# EAGLE design sacredHeart (EAGLE 9.1.3)
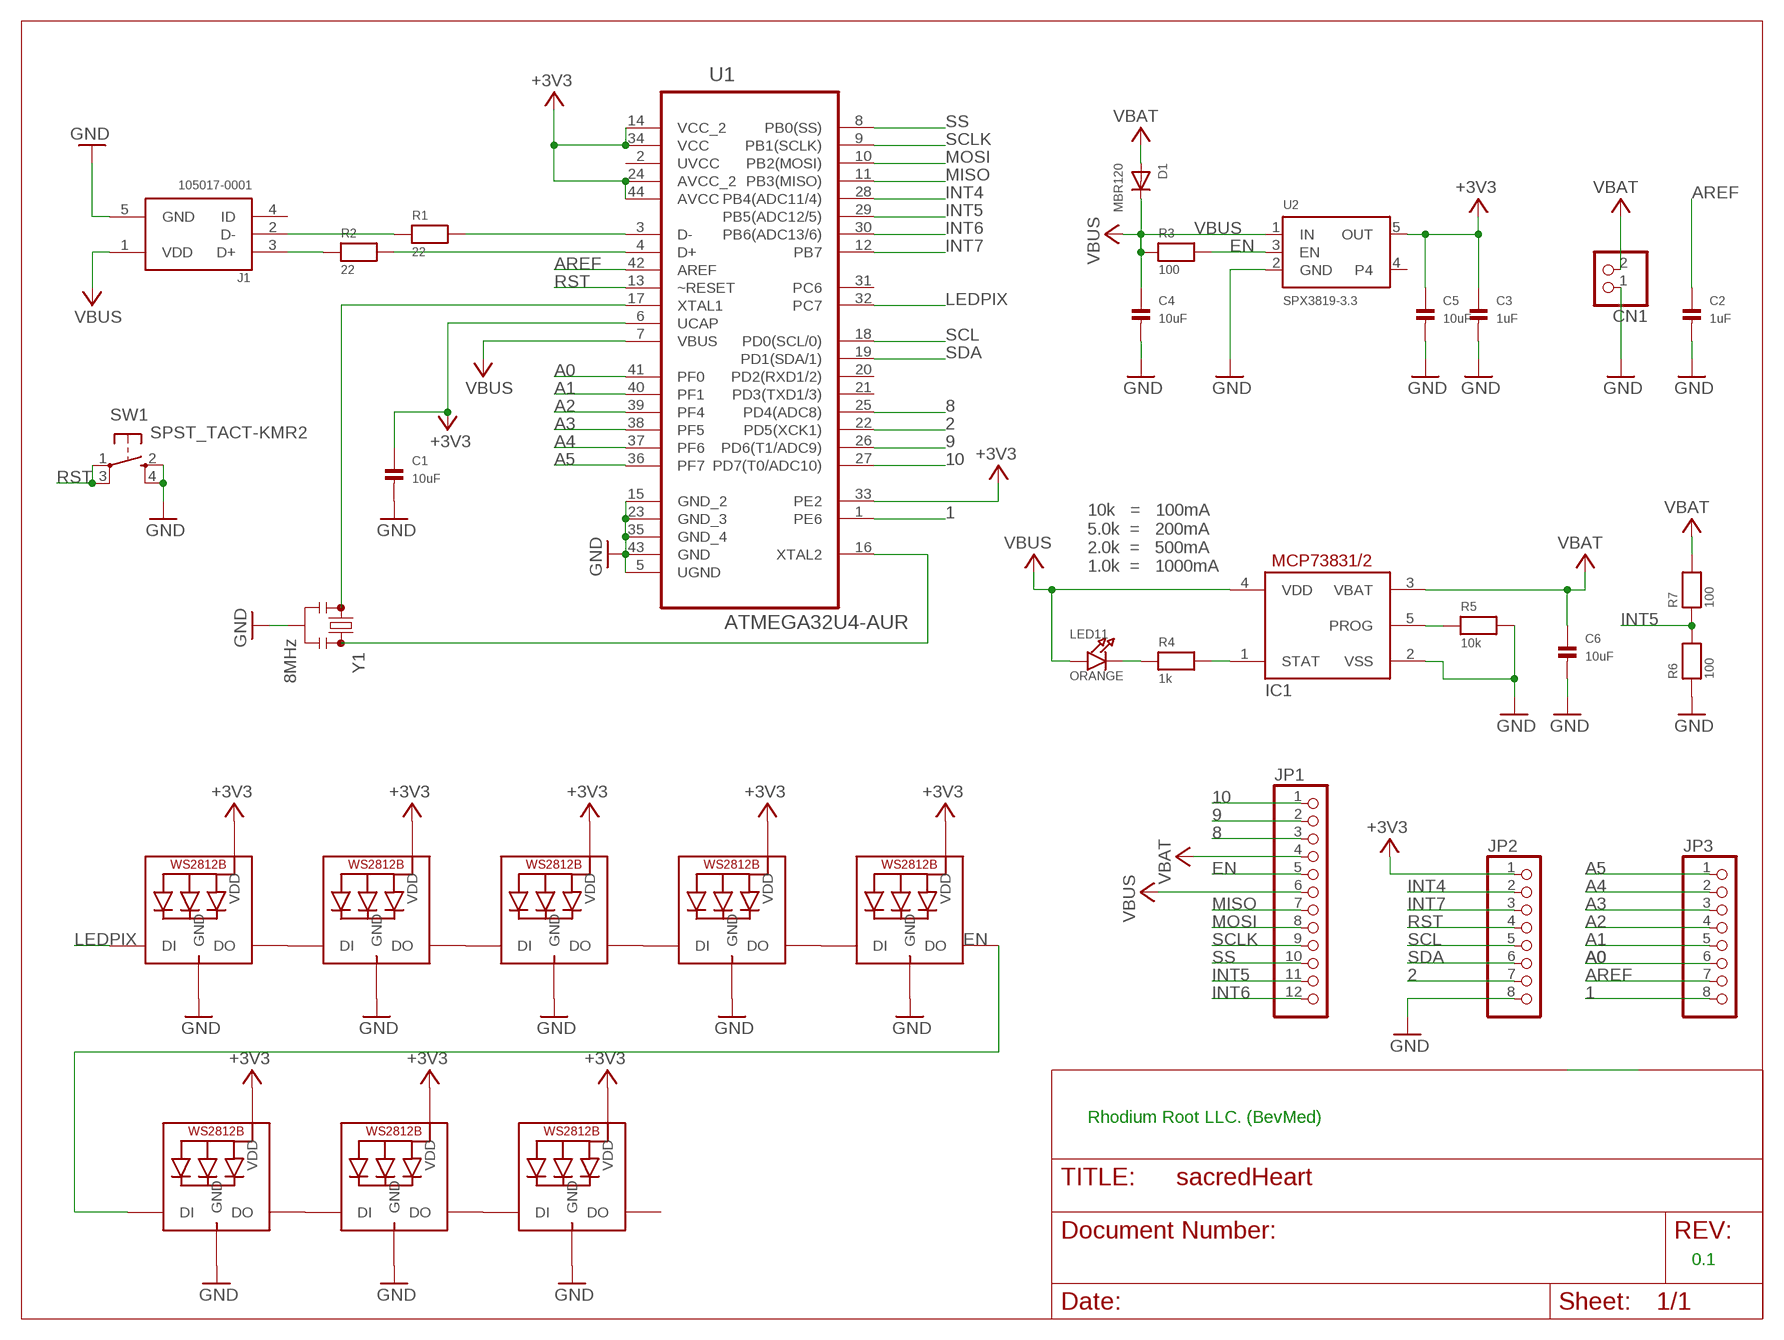
[diagram p0: schematic, sheet 1]

## Parts
C1  10uF  CAP_CERAMIC0805  [0805]
C2  1uF  CAP_CERAMIC0805  [0805]
C3  1uF  CAP_CERAMIC0805  [0805]
C4  10uF  CAP_CERAMIC0805  [0805]
C5  10uF  CAP_CERAMIC0805  [0805]
C6  10uF  CAP_CERAMIC0805  [0805]
CN1  JST_2PIN  [JSTPH2]
D1  MBR120  DIODESOD-123  [SOD-123]
IC1  MCP73831/OT  [SOT23-5L]
J1  105017-0001  [MOLEX_105017-0001]
JP1  HEADER-1X12  [1X12_ROUND]
JP2  HEADER-1X8ROUND  [1X08_ROUND]
JP3  HEADER-1X8ROUND  [1X08_ROUND]
LED1  WS2812B3535  [LED3535]
LED2  WS2812B3535  [LED3535]
LED3  WS2812B3535  [LED3535]
LED4  WS2812B3535  [LED3535]
LED5  WS2812B3535  [LED3535]
LED6  WS2812B3535  [LED3535]
LED7  WS2812B3535  [LED3535]
LED8  WS2812B3535  [LED3535]
LED11  ORANGE  LED0805_NOOUTLINE  [CHIPLED_0805_NOOUTLINE]
R1  22  RESISTOR0603  [0603]
R2  22  RESISTOR0603  [0603]
R3  100  RESISTOR0603  [0603]
R4  1k  RESISTOR0603  [0603]
R5  10k  RESISTOR0603  [0603]
R6  100  RESISTOR0603  [0603]
R7  100  RESISTOR0603  [0603]
SW1  SPST_TACT-KMR2  [KMR2]
U1  ATMEGA32U4-AUR  [QFP80P1200X1200X120-44N]
U2  SPX3819-3.3  VREG_SOT23-5  [SOT23-5]
Y1  8MHz  RESONATOR-8MHZSMD_3.2X1.3  [RESONATOR-SMD-3.2X1.3]

## Nets
1: JP3.8 U1.1(PE6)
2: JP2.7 U1.22(PD5(XCK1))
8: JP1.3 U1.25(PD4(ADC8))
9: JP1.2 U1.26(PD6(T1/ADC9))
10: JP1.1 U1.27(PD7(T0/ADC10))
+3V3: C1.1 C3.1 C5.1 JP2.1 LED1.2(VDD) LED2.2(VDD) LED3.2(VDD) LED4.2(VDD) LED5.2(VDD) LED6.2(VDD) LED7.2(VDD) LED8.2(VDD) U1.6(UCAP) U1.14(VCC_2) U1.24(AVCC_2) U1.33(PE2) U1.34(VCC) U1.44(AVCC) U2.5(OUT)
A0: JP3.6 U1.41(PF0)
A1: JP3.5 U1.40(PF1)
A2: JP3.4 U1.39(PF4)
A3: JP3.3 U1.38(PF5)
A4: JP3.2 U1.37(PF6)
A5: JP3.1 U1.36(PF7)
AREF: C2.1 JP3.7 U1.42(AREF)
EN: JP1.5 R3.2 U2.3(EN)
GND: C1.2 C2.2 C3.2 C4.2 C5.2 C6.2 CN1.1 IC1.2(VSS) J1.5(GND) JP2.8 LED1.4(GND) LED2.4(GND) LED3.4(GND) LED4.4(GND) LED5.4(GND) LED6.4(GND) LED7.4(GND) LED8.4(GND) R5.2 R6.1 SW1.2(S) SW1.4(S1) U1.5(UGND) U1.15(GND_2) U1.23(GND_3) U1.35(GND_4) U1.43(GND) U2.2(GND) Y1.2
INT4: JP2.2 U1.28(PB4(ADC11/4))
INT5: JP1.11 R6.2 R7.1 U1.29(PB5(ADC12/5))
INT6: JP1.12 U1.30(PB6(ADC13/6))
INT7: JP2.3 U1.12(PB7)
LEDPIX: LED1.1(DI) U1.32(PC7)
MISO: JP1.7 U1.11(PB3(MISO))
MOSI: JP1.8 U1.10(PB2(MOSI))
N$2: IC1.5(PROG) R5.1
N$4: R1.2 U1.3(D-)
N$5: LED2.3(DO) LED3.1(DI)
N$6: LED3.3(DO) LED4.1(DI)
N$7: IC1.1(STAT) R4.2
N$8: LED11.C R4.1
N$9: R2.2 U1.4(D+)
N$10: J1.2(D-) R1.1
N$11: J1.3(D+) R2.1
N$12: U1.16(XTAL2) Y1.3
N$13: U1.17(XTAL1) Y1.1
N$14: LED1.3(DO) LED2.1(DI)
N$15: LED7.3(DO) LED8.1(DI)
N$17: LED6.3(DO) LED7.1(DI)
N$18: LED4.3(DO) LED5.1(DI)
N$22: LED5.3(DO) LED6.1(DI)
RST: JP2.4 SW1.1(P) SW1.3(P1) U1.13(~RESET)
SCL: JP2.5 U1.18(PD0(SCL/0))
SCLK: JP1.9 U1.9(PB1(SCLK))
SDA: JP2.6 U1.19(PD1(SDA/1))
SS: JP1.10 U1.8(PB0(SS))
VBAT: C6.1 CN1.2 D1.A IC1.3(VBAT) JP1.4 R7.2
VBUS: C4.1 D1.C IC1.4(VDD) J1.1(VDD) JP1.6 LED11.A R3.1 U1.7(VBUS) U2.1(IN)
Unconnected: J1.4(ID) LED8.3(DO) U1.20(PD2(RXD1/2)) U1.21(PD3(TXD1/3)) U1.31(PC6) U2.4

## Notes on the sheet
- 10k   =   100mA
  5.0k  =   200mA
  2.0k  =   500mA
  1.0k  =   1000mA
- Rhodium Root LLC. (BevMed)
- 0.1

## Power pins joined to a net without a drawn wire
UVCC: U1.2(UVCC)

## Library data of the parts
C1 C3-C5 = microbuilder:CAP_CERAMIC: Ceramic Capacitors 0402 - 0402 Surface Mount Capacitors 16pF 50V 5% [Digikey: 445-4899-2-ND] 18pF 50V 5% [Digikey: 490-1281-2-ND] 22pF 50V 5% [Digikey: 490-1283-2-ND] 68pF 50V 5% [Digikey: 490-1289-2-ND] 0.1uF 10V 10% [Digikey: 490-1318-2-ND] 1.0uF 6.3V 10% [Digikey: 490-1320-2-ND] 0603 - 0603 Surface Mount Capacitors 16 pF 50V 5% [Digikey: 445-5051-2-ND] 22 pF 50V [Digikey: PCC220ACVTR-ND] 33 pF 50V 5% [Digikey: 490-1415-1-ND] 56pF 50V 5% [Digikey: 490-1421-1-ND] 220pF 50V 5% [Digikey: 445-1285-1-ND] 680 pF 50V 2200 pF 50V 5% C0G [Digikey: 445-1297-1-ND] 5600 pF 100V 5% X7R [Digikey: 478-3711-1-ND] 0.1 µF 25V 10% [Digikey: PCC2277TR-ND] 0.22 µF 16V 10% X7R [Digikey: 445-1318-1-ND] 1.0 µF 25V 10% [Digikey: 445-5146-2-ND] 0603 - RF Specific 3pF 250V +/-0.1pF RF [Digikey: 712-1347-1-ND] 18 pF 250V 5% [Digikey: 478-3505-1-ND or 712-1322-1-ND] 56 pF 250V 5% C0G RF [Digikey: 490-4867-1-ND] 68 pF 250V RF [Digikey: 490-4868-1-ND] 0805 - 0805 Surface Mount Capacitors 220 pF 250V 2% RF Ceramic Capacitor [Digikey: 712-1398-1-ND] 1000 pF 50V 2% NP0 Ceramic Capacitor [Digikey: 478-3760-1-ND] 0.1 µF 25V 10% Ceramic Capacitor [Digikey: PCC1828TR-ND] 1.0 µF 16V 10% Ceramic Capacitor[Digikey: 490-1691-2-ND] 10.0 µF 10V 10% Ceramic Capacitor[Digikey: 709-1228-1-ND] 10.0 uF 16V 10% Ceramic Capacitor [Digikey: 478-5165-2-ND] 47 uF 6.3V 20% Ceramic Capacitor [Digikey: 587-1779-1-ND or 399-5506-1-ND] 1206 - 1206 Surface Mount Capacitors 47uF 10V 20% Ceramic Capacitor [Digikey: 490-5528-1-ND or 399-5508-1-ND or 445-6010-1-ND] 100uF 6.3V -20%, +80% Y5V Ceramic Capacitor (Digikey: 490-4512-1-ND, Mouser: 81-GRM31CF50J107ZE1L)
C2 C6 = microbuilder:CAP_CERAMIC: Ceramic Capacitors 0402 - 0402 Surface Mount Capacitors 16pF 50V 5% [Digikey: 445-4899-2-ND] 18pF 50V 5% [Digikey: 490-1281-2-ND] 22pF 50V 5% [Digikey: 490-1283-2-ND] 68pF 50V 5% [Digikey: 490-1289-2-ND] 0.1uF 10V 10% [Digikey: 490-1318-2-ND] 1.0uF 6.3V 10% [Digikey: 490-1320-2-ND] 0603 - 0603 Surface Mount Capacitors 16 pF 50V 5% [Digikey: 445-5051-2-ND] 22 pF 50V [Digikey: PCC220ACVTR-ND] 33 pF 50V 5% [Digikey: 490-1415-1-ND] 56pF 50V 5% [Digikey: 490-1421-1-ND] 220pF 50V 5% [Digikey: 445-1285-1-ND] 680 pF 50V 2200 pF 50V 5% C0G [Digikey: 445-1297-1-ND] 5600 pF 100V 5% X7R [Digikey: 478-3711-1-ND] 0.1 µF 25V 10% [Digikey: PCC2277TR-ND] 0.22 µF 16V 10% X7R [Digikey: 445-1318-1-ND] 1.0 µF 25V 10% [Digikey: 445-5146-2-ND] 0603 - RF Specific 3pF 250V +/-0.1pF RF [Digikey: 712-1347-1-ND] 18 pF 250V 5% [Digikey: 478-3505-1-ND or 712-1322-1-ND] 56 pF 250V 5% C0G RF [Digikey: 490-4867-1-ND] 68 pF 250V RF [Digikey: 490-4868-1-ND] 0805 - 0805 Surface Mount Capacitors 220 pF 250V 2% RF Ceramic Capacitor [Digikey: 712-1398-1-ND] 1000 pF 50V 2% NP0 Ceramic Capacitor [Digikey: 478-3760-1-ND] 0.1 µF 25V 10% Ceramic Capacitor [Digikey: PCC1828TR-ND] 1.0 µF 16V 10% Ceramic Capacitor[Digikey: 490-1691-2-ND] 10.0 µF 10V 10% Ceramic Capacitor[Digikey: 709-1228-1-ND] 10.0 uF 16V 10% Ceramic Capacitor [Digikey: 478-5165-2-ND] 47 uF 6.3V 20% Ceramic Capacitor [Digikey: 587-1779-1-ND or 399-5506-1-ND] 1206 - 1206 Surface Mount Capacitors 47uF 10V 20% Ceramic Capacitor [Digikey: 490-5528-1-ND or 399-5508-1-ND or 445-6010-1-ND] 100uF 6.3V -20%, +80% Y5V Ceramic Capacitor (Digikey: 490-4512-1-ND, Mouser: 81-GRM31CF50J107ZE1L); SPICEPREFIX: C
CN1 = microbuilder:JST_2PIN: JST 2-Pin Right-Angle Connector PH-Series - 4UConnector: 17311 SH-Series - 4UConnector: 07278
D1 = microbuilder:DIODE: Diode SMA Model Volts Amps Type Vf Vr Digikey # Notes SSA34-E3 40V 3A Schottky 480mV @ 3A 200uA @ 40V SSA34-E3/61TGITR-ND CDBA120-G 20V 1A Schottky 500mV @ 1A 500uA @ 20V 641-1014-6-ND REEL MBRA210 10V 2A Schottky 350mV @ 2A 700uA @ 10V MBRA210LT3 SOD-123 Model Volts Amps Type Vf Vr Order # Notes BAT54T1G 30V 200mA Schottky 800mV @ 200mA 2uA @ 25V BAT54T1GOSTR-ND B0530W 30V 500mA Schottky 430mV @ 500mA 130uA @ 30V B0530W-FDICT-ND REEL MBR120 1A 20V Schottky 340mV @ 1A MBR120VLSFT1GOSCT-ND SOD-323 Model Volts Amps Type Vf Vr Order # Notes PMEG2005EJ 20V 500mA Schottky 355mV @ 500mA 568-4110-1-ND ZLLS410 10V 570mA Schottky 380mV @ 570mA ZLLS410CT-ND 1N4148WS 75V 150mA Silicon/Simple 1V 1N4148WSFSCT-ND REEL SOD-523 Model Volts Amps Type Vf Vr Order # Notes BAT54XV2 30V 200mA Schottky 0.8V @ 100mA BAT54XV2CT-ND TB751S 30V 30mA Schottky RB751S-40TE61CT-ND SOT23-R/W (R = Solder Paste/Reflow Ovens, W = Hand-Soldering) Model Volts Amps Type Vf Vr Order # Notes BAT54FILM 40V 300mA Schottky 497-7162-1-ND
IC1 = adafruit:MCP73831: MCP73831/2 Miniature Single-Cell, Fully Integrated Li-Ion, Li-Polymer Charge Management Controllers. Nice and small simple lipoly charge controller, with adjustable current and status output (LED) http://www.ladyada.net/library/pcb/eaglelibrary.html
J1 = 105017-0001:105017-0001; AVAILABILITY: Unavailable; DESCRIPTION: Conn USB Type B M 5 POS 0.65mm Solder RA Thru-Hole 5 Terminal 1 Port Embossed T/R; MF: Molex; MP: 105017-0001; PACKAGE: None; PRICE: None
JP1 = microbuilder:HEADER-1X12
JP2 JP3 = microbuilder:HEADER-1X8: PIN HEADER
LED1-LED8 = adafruit:WS2812B
LED11 = microbuilder:LED: LED 0603 - 0603 Surface Mount Package 2mA: Green LED - Low Power (3.9mcd, 2ma, 1.7Vf) - Digikey: 475-2709-2-ND Orange LED - Low Power (9.8mcd, 2ma, 1.8Vf) - Digikey: 475-1194-2-ND Red LED - Low Power (5mcd, 2ma, 1.8Vf) - Digikey: 475-1195-2-ND Yellow LED - Low Power (7mcd, 2ma, 1.8Vf) - Digikey: 475-1196-2-ND 5mA: Blue LED - Low Power (17mcd, 5ma, 2.9Vf) - Digikey: LNJ937W8CRACT-ND 0805 - 0805 Surface Mount Package 2mA: Red LED (8.8mcd, 2mA, 1.8Vf, Clear) - Low Power [Digikey: 475-2510-1-ND] Green LED (5mcd, 2mA, 1.8Vf, Clear) - Low Power [Digikey: 475-2730-1-ND] Yellow LED (11.3mcd, 2mA, 1.8Vf, Clear) - Low Power [Digikey: 475-2555-1-ND] 20mA: Red LED (104mcd, 20mA, Diffused) - LS R976 [Digikey: 475-1278-6-ND] Red LED (12mcd, 20mA, 2.0Vf, Clear) - APT2012EC [Digikey: 754-1128-1-ND] Green LED (15mcd, 20mA, 2.2Vf, Clear) - APT2012GC [Digikey: 754-1131-1-ND] Orange LED (160mcd, 20mA, 2.1Vf, Clear) - APT2012SECK [Digikey: 754-1130-1-ND] 1206 - 1206 Surface Mount Package Green LED (26mcd, 20mA, Diffused) - LG N971 [Digikey: 475-1407-6-ND] Red LED (15mcd, 20mA, Diffused) - LH N974 [Digikey: 475-1416-6-ND]
R1-R7 = microbuilder:RESISTOR: Resistors 0402 - 0402 Surface Mount Package 22 Ohm 1% 1/16W [Digikey: 311-22.0LRTR-ND] 33 Ohm 5% 1/16W 1.0K 5% 1/16W 1.5K 5% 1/16W 2.0K 1% 1/16W 10.0K 1% 1/16W [Digikey: 311-10.0KLRTR-ND] 10.0K 5% 1/16W [Digikey: RMCF0402JT10K0TR-ND] 12.1K 1% 1/16W [Digikey: 311-22.0LRTR-ND] 100.0K 5% 1/16W 0603 - 0603 Surface Mount Package 0 Ohm 1/10 Watt 1% Resistor 15 Ohm 1/10 Watt 1% Resistor 33 Ohm 1/10 Watt 1% Resistor 49.9 Ohm 1/10 Watt 1% Resistor 100 Ohm 1/10 Watt 1% Resistor 150 Ohm 1/10 Watt 1% Resistor 240 Ohm 1/10 Watt 1% Resistor 390 Ohm 1/10 Watt 1% Resistor 560 Ohm 1/10 Watt 1% Resistor 680 Ohm 1/10 Watt 1% Resistor 750 Ohm 1/10 Watt 1% Resistor 1.0K Ohm 1/10 Watt 1% Resistor 1.5K Ohm 1/10 Watt 1% Resistor 2.0K Ohm 1/10 Watt 1% Resistor 2.2K Ohm 1/10 Watt 1% Resistor 3.3K Ohm 1/10 Watt 1% Resistor 4.7K Ohm 1/10 Watt 1% Resistor 10.0K Ohm 1/10 Watt 1% Resistor 12.0K Ohm 1/10 Watt 1% Resistor 12.1K Ohm 1/10 Watt 1% Resistor 20.0K Ohm 1/10 Watt 1% Resistor 33.0K Ohm 1/10 Watt 1% Resistor 100.0K Ohm 1/10 Watt 1% Resistor 0805 - 0805 Surface Mount Package 0 Ohm 1/8 Watt 1% Resistor 33 Ohm 1/8 Watt 1% Resistor 100 Ohm 1/8 Watt 1% Resistor 150 Ohm 1/8 Watt 1% Resistor 200 Ohm 1/8 Watt 1% Resistor 240 Ohm 1/8 Watt 1% Resistor 330 Ohm 1/8 Watt 1% Resistor 390 Ohm 1/8 Watt 1% Resistor 470 Ohm 1/8 Watt 1% Resistor 1.0K Ohm 1/8 Watt 1% Resistor 1.5K Ohm 1/8 Watt 1% Resistor 2.0K Ohm 1/8 Watt 1% Resistor 4.7K Ohm 1/8 Watt 1% Resistor 5.1K Ohm 1/8 Watt 1% Resistor 5.6K Ohm 1/8 Watt 1% Resistor 10.0K Ohm 1/8 Watt 1% Resistor 22.0K Ohm 1/8 Watt 1% Resistor 33.0K Ohm 1/8 Watt 1% Resistor 100K Ohm 1/8 Watt 1% Resistor 1206 - 1206 Surface Mount Package 2012 - 2010 Surface Mount Package 0.11 Ohm 1/2 Watt 1% Resistor - Digikey: RHM.11UCT-ND
SW1 = adafruit:SPST_TACT: SMT 6mm switch, EVQQ2 series http://www.ladyada.net/library/eagle
U1 = ATMEGA32U4-AUR:ATMEGA32U4-AUR: 8-bit Microcontroller with ISP Flash and USB Controller; AVAILABILITY: Unavailable; DESCRIPTION: ATmega Series 16 MHz 32 KB Flash 2.5 KB SRAM 8-Bit Microcontroller - TQFP-44; MF: Microchip; MP: ATMEGA32U4-AUR; PACKAGE: TQFP-44 Atmel; PRICE: None
U2 = microbuilder:VREG_SOT23-5: SOT23-5 Fixed Voltage Regulators To better organise some of the SOT23-5 fixed voltage regulators in this library, this new part was created. Part Current Out V Out V In V Dropout Digikey Part No. ADP121 150mA 3.3V 3.4-5.5V 0.09V @ 150mA ADP121-AUJZ33R7CT-ND ADP121 150mA 3.0V 3.1-5.5V 0.09V @ 150mA ADP121-AUJZ30R7CT-ND ADP122 300mA 3.3V 3.4-5.5V 0.085V @ 300mA ADP122AUJZ-3.3-R7CT-ND ADP1712 300mA 3.3V 3.5-5.5V 0.17V @ 300mA ADP1712AUJZ-3.3-R7TR-ND AP7311 (Low Cost) 150mA 3.3V 3.5-6V 0.15V @ 150mA AP7311-33WG-7DICT-ND LD39015M18R 150mA 1.8V 1.9V-5.5V 0.08V @ 100mA 497-6977-1-ND MCP1824T-3302E/OT 300mA 3.3V 3.5V-6V 0.2V @ 300mA MCP1824T-3302E/OTCT-ND MIC5205-2.5YM5 TR 150mA 2.5V 2.7-16V 0.165V @ 150mA 576-1257-2-ND MIC5205-3.0YM5 TR 150mA 3.0V 3.2V-16V 0.165V @ 150mA 576-1258-2-ND MIC5205-3.3YM5 TR 150mA 3.3V 3.5V-16V 0.165V @ 150mA 576-1259-2-ND TPS780330220 150mA 3.3V+2.2V 3.6-5.5V 250mV Max 296-23332-1-ND TDA3663/N1,135 100mA 3.3V 3.5-45V 0.18V @ 50mA 568-5343-1-ND
Y1 = SparkFun-Clocks:RESONATOR-8MHZ: 8MHz Resonator Digikey Example <http://www.digikey.com/product-detail/en/murata-electronics-north-america/CSTCE10M0G55-R0/490-1196-1-ND/584633> Frequency: 8MHz Frequency Stability: ±0.2% Frequency Tolerance: ±0.5% Capacitance: 33pF SparkFun Products Arduino Pro Mini 328- 3.3V/8MHz <https://www.sparkfun.com/products/11114> SparkFun Digital Sandbox <https://www.sparkfun.com/products/12651>; PROD_ID: XTAL-08895

## Board
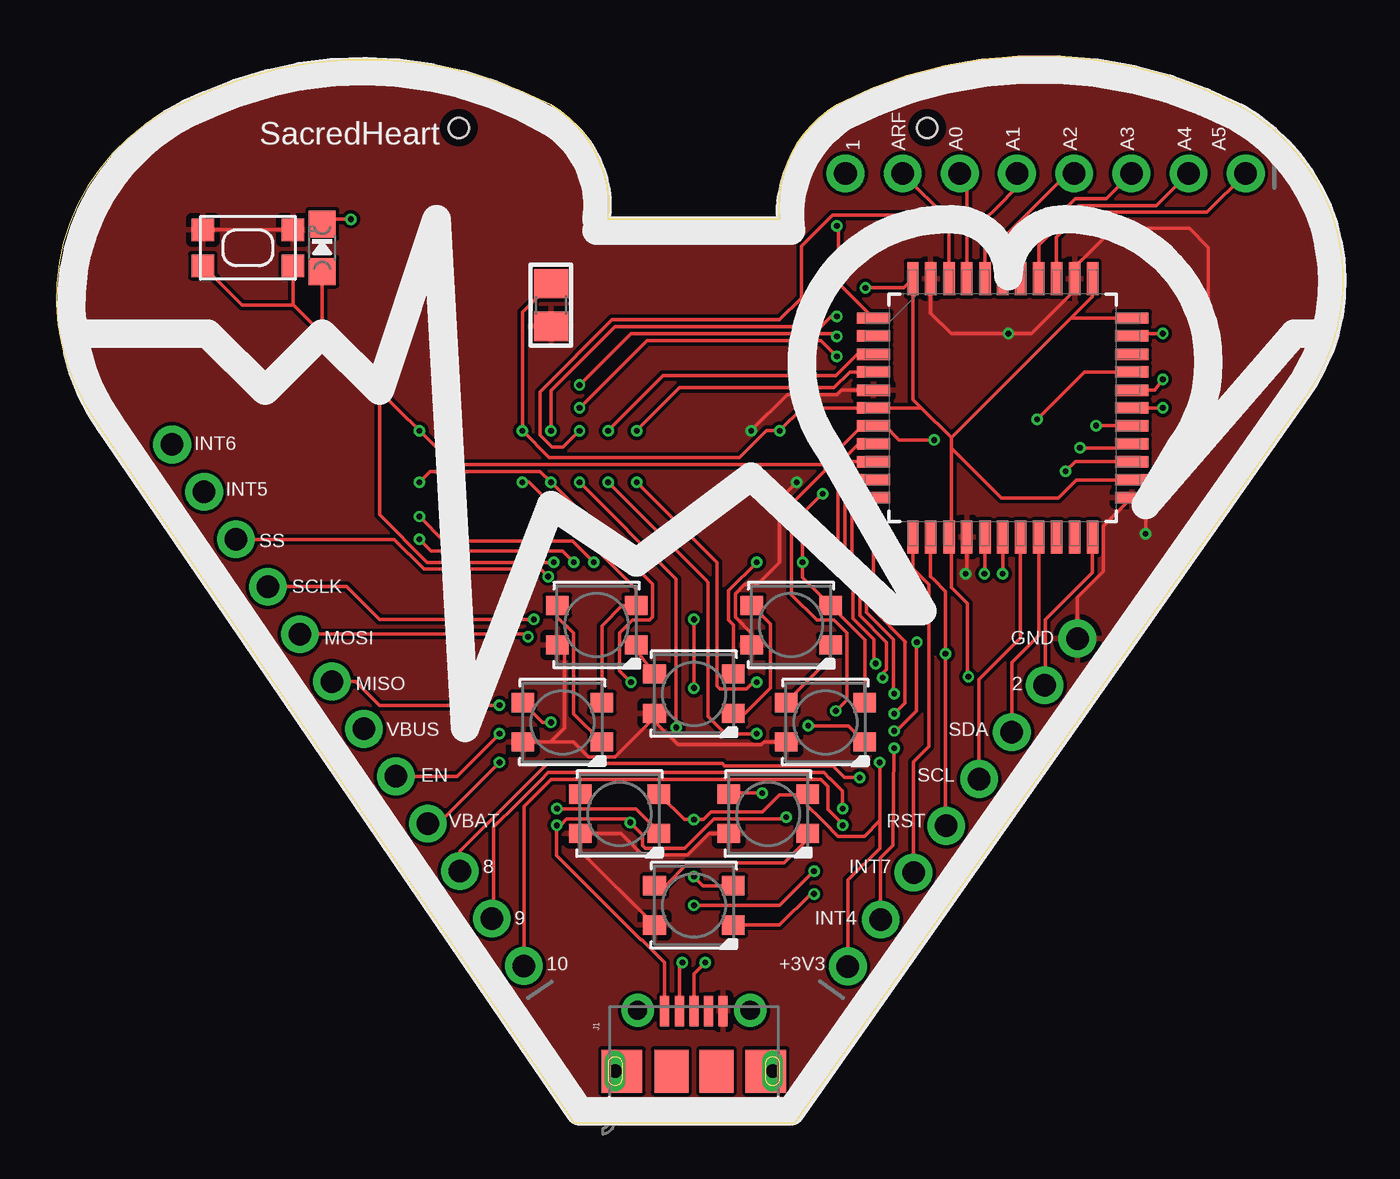
[diagram p1: board, top side]
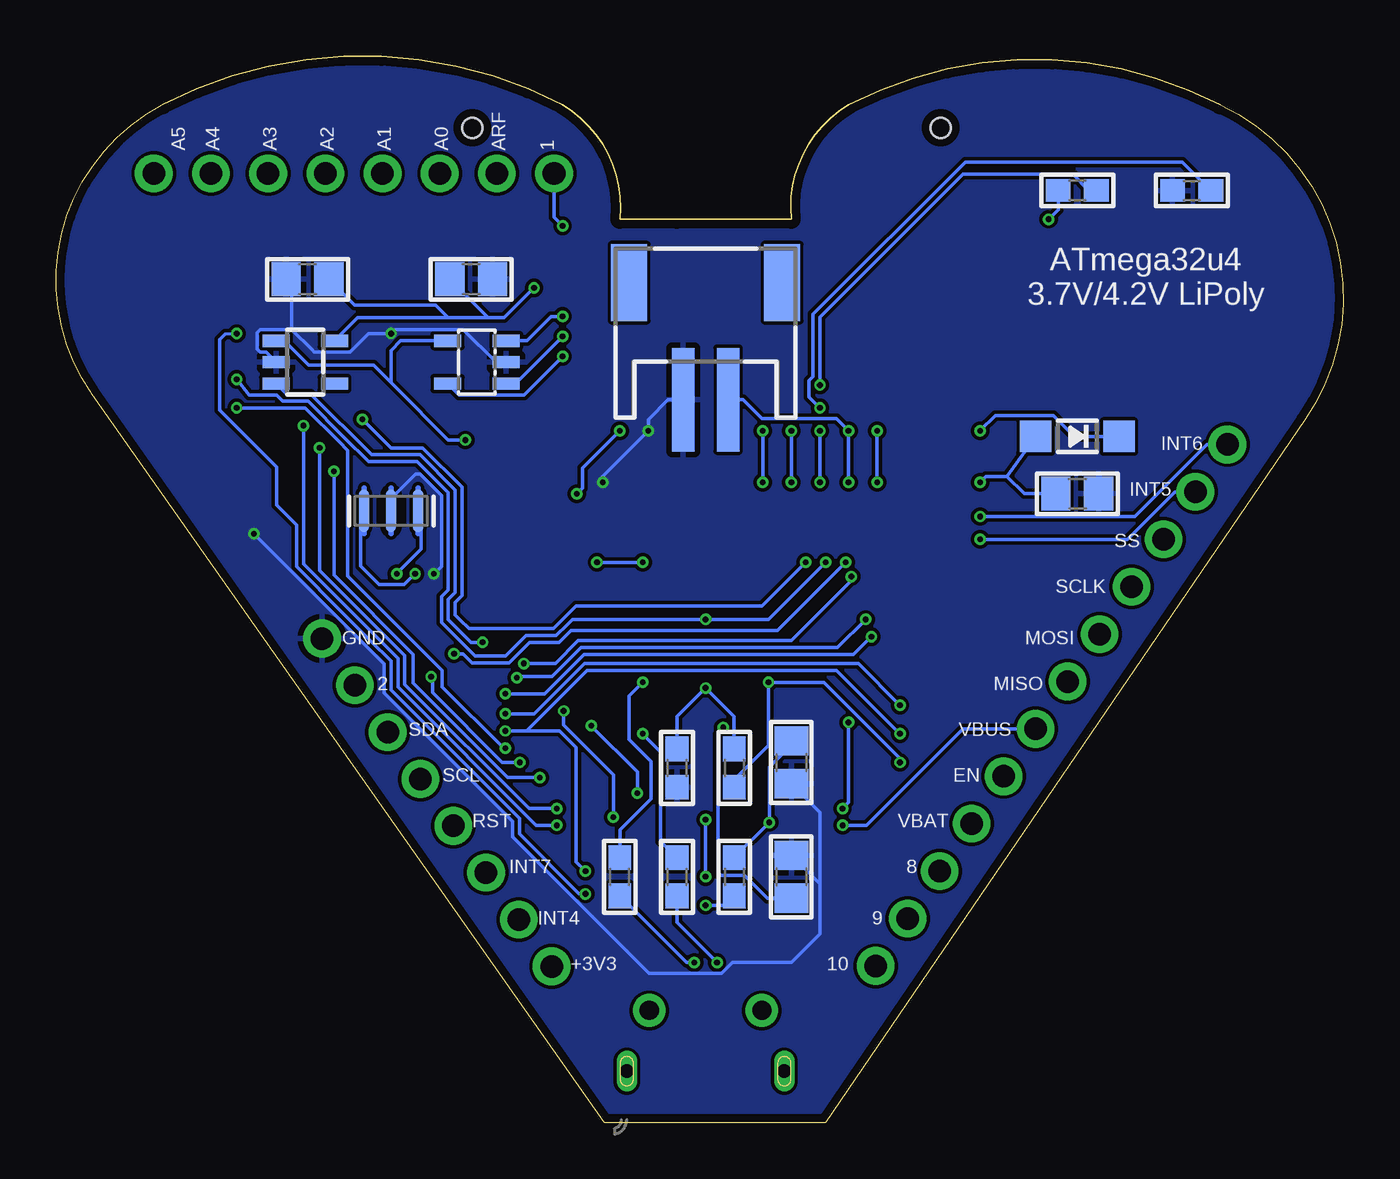
[diagram p2: board, bottom side, seen from below]

Size 57.16 x 47.37 mm. Coordinates in mm from the lower left corner, seen from the top.
Outline: 22.99,0 32.82,0 55.57,32.34 arc97 52.45,45.21 arc55 34.67,45.21 arc65 32.13,40.13 29.59,40.13 24.51,40.13 arc65 21.97,45.21 arc55 5.46,45.21 arc100 1.72,31.21 22.99,0
Copper layers (1*16): Top 0.035559375mm / dielectric 1.6mm / Bottom 0.035559375mm
Design rules "oshpark-2layer": minimum track width 6mil, minimum drill 10mil, track to track 6mil, track to pad 6mil, pad to pad 6mil, via to via 6mil, smd to smd 6mil, copper to edge 15mil, drill to drill 6mil, minimum pad ring 5mil, minimum via ring 5mil, stop-mask expansion 2.5mil, vias tented up to drill 0mil, thermal gap 10mil
Holes 0.9 mm at 17.88,44.2 38.69,44.2

### Footprints (pad centres in the part's own frame; a part is rotated, then mirrored left to right if it is on the bottom)
0805 = smd 1.3 x 1.5: 1 -0.95,0; 2 0.95,0
JSTPH2 = smd 1 x 4.6: 1 -1,-3.7; 2 1,-3.7 | smd 1.6 x 3.4: NC1 -3.4,1.5; NC2 3.4,1.5
SOD-123 = smd 1.4 x 1.4: A 1.85,0; C -1.85,0
SOT23-5L = smd 0.55 x 1.2: 1 -0.95,-1.3; 2 0,-1.3; 3 0.95,-1.3; 4 0.95,1.3; 5 -0.95,1.3
MOLEX_105017-0001 = smd 0.4 x 1.35: 1 -1.3,2.675; 2 -0.65,2.675; 3 0,2.675; 4 0.65,2.675; 5 1.3,2.675 | drill 0.85 pad 1.45: P$1 -2.5,2.7; P$2 2.5,2.7 | smd 1.5 x 1.9: P$8 -1,0; P$9 1,0 | smd 1.8 x 1.9: P$10 -3.2,0; P$11 3.2,0 | drill 0.6 pad 0.8 long: P$12 -3.5,0; P$13 3.5,0
1X12_ROUND = drill 1 pad 1.676: 1 -13.97,0; 2 -11.43,0; 3 -8.89,0; 4 -6.35,0; 5 -3.81,0; 6 -1.27,0; 7 1.27,0; 8 3.81,0; 9 6.35,0; 10 8.89,0; 11 11.43,0; 12 13.97,0
1X08_ROUND = drill 1 pad 1.676: 1 -8.89,0; 2 -6.35,0; 3 -3.81,0; 4 -1.27,0; 5 1.27,0; 6 3.81,0; 7 6.35,0; 8 8.89,0
LED3535 = smd 1 x 0.85: 1 -1.75,0.875; 2 -1.75,-0.875; 3 1.75,-0.875; 4 1.75,0.875
CHIPLED_0805_NOOUTLINE = smd 1.2 x 1.2: A 0,-1.05; C 0,1.05
0603 = smd 1.1 x 1: 1 -0.85,0; 2 0.85,0
KMR2 = smd 1 x 1: 1 2,0.8; 2 2,-0.8; 3 -2,0.8; 4 -2,-0.8
QFP80P1200X1200X120-44N = smd 1.473 x 0.508: 1 -5.74,3.988; 2 -5.74,3.2; 3 -5.74,2.388; 4 -5.74,1.6; 5 -5.74,0.787; 6 -5.74,0; 7 -5.74,-0.787; 8 -5.74,-1.6; 9 -5.74,-2.388; 10 -5.74,-3.2; 11 -5.74,-3.988; 23 5.74,-3.988; 24 5.74,-3.2; 25 5.74,-2.388; 26 5.74,-1.6; 27 5.74,-0.787; 28 5.74,0; 29 5.74,0.787; 30 5.74,1.6; 31 5.74,2.388; 32 5.74,3.2; 33 5.74,3.988 | smd 0.508 x 1.473: 12 -3.988,-5.74; 13 -3.2,-5.74; 14 -2.388,-5.74; 15 -1.6,-5.74; 16 -0.787,-5.74; 17 0,-5.74; 18 0.787,-5.74; 19 1.6,-5.74; 20 2.388,-5.74; 21 3.2,-5.74; 22 3.988,-5.74; 34 3.988,5.74; 35 3.2,5.74; 36 2.388,5.74; 37 1.6,5.74; 38 0.787,5.74; 39 0,5.74; 40 -0.787,5.74; 41 -1.6,5.74; 42 -2.388,5.74; 43 -3.2,5.74; 44 -3.988,5.74
SOT23-5 = smd 0.55 x 1.2: 1 -0.95,-1.3; 2 0,-1.3; 3 0.95,-1.3; 4 0.95,1.3; 5 -0.95,1.3
RESONATOR-SMD-3.2X1.3 = smd 0.45 x 1.905: 1 -1.2,0; 2 0,0; 3 1.2,0

### Placement (x,y rotation side)
C1  21.97,36.32 270 top
C2  24.51,10.92 90 bottom
C3  38.74,37.46 0 bottom
C4  24.51,16 270 bottom
C5  46,37.46 180 bottom
C6  11.81,27.94 0 bottom
CN1  28.32,35.81 0 bottom
D1  11.81,30.48 180 bottom
IC1  38.48,33.78 90 bottom
J1  28.32,2.29 0 top
JP1  12.96,18.54 124 top
JP2  40.26,14.22 55 top
JP3  43.94,42.16 180 top
LED1  28.32,9.65 180 top
LED2  31.62,13.72 180 top
LED3  34.16,17.78 180 top
LED4  32.64,22.1 180 top
LED5  28.32,19.05 180 top
LED6  24,22.1 180 top
LED7  22.48,17.78 180 top
LED8  25.02,13.72 180 top
LED11  11.81,38.86 0 top
R1  29.59,10.92 90 bottom
R2  32.13,10.92 90 bottom
R3  27.05,10.92 270 bottom
R4  11.81,41.4 0 bottom
R5  6.73,41.4 180 bottom
R6  29.59,15.75 90 bottom
R7  27.05,15.75 270 bottom
SW1  8.51,38.86 180 top
U1  42.04,31.75 0 top
U2  46.1,33.78 270 bottom
Y1  42.29,27.18 180 bottom

### Tracks (layer width: path | path; a pad name or v marks a point on that pad's centre or on a via)
1  (via drill 0.25)
  Top 0.152: U1.1 34.75,37.28 34.75,39.75 v34.67,39.83
  Bottom 0.152: JP3.8 35.05,40.21 v34.67,39.83
2
  Top 0.152: U1.22 46.03,24.44 44.39,22.8 | 43.94,22.35 44.39,22.8 | 43.94,22.35 44.39,22.8 | 43.94,22.35 | JP2.7 43.94,19.47 43.94,22.35
8  (via drill 0.25)
  Top 0.152: v44.83,28.93 45.26,29.36 U1.25 | v35.69,15.33 35.02,15.33 34.49,15.85 29.68,15.85 29.59,15.95 21.81,15.95 17.93,12.06 JP1.3
  Bottom 0.152: v44.83,28.93 44.83,24.33 41.3,20.8 41.3,19.52 37.11,15.33 v35.69,15.33
9  (via drill 0.25)
  Top 0.152: U1.26 47.6,29.97 v45.47,29.97 | JP1.2 19.43,9.15 19.43,12.19 19.43,13.14 20.46,14.17 | 20.46,14.17 21.5,15.2 | 21.5,15.2 21.85,15.55 | 21.85,15.55 | 21.85,15.55 21.97,15.55 21.85,15.55 | 21.85,15.55 | 21.85,15.55 21.5,15.2 | 21.5,15.2 20.46,14.17 | 21.85,15.55 21.5,15.2 | v34.93,13.95 34.93,14.73 34.36,15.3 34.35,15.3 34.1,15.55 21.85,15.55
  Bottom 0.152: v45.47,29.97 45.47,24.53 41.68,20.75 41.68,19.47 36.16,13.95 v34.93,13.95
10  (via drill 0.25)
  Top 0.152: U1.27 v46.18,30.96 | JP1.1 20.77,14.04 21.97,15.24 33.97,15.24 34.29,14.93 34.29,13.91 34.93,13.27 v34.93,13.21
  Bottom 0.152: v46.18,30.96 46.18,24.82 41.99,20.62 41.99,19.34 35.85,13.21 v34.93,13.21
+3V3  (via drill 0.25)
  Top 0.152: 39.75,26.11 U1.14 | 38.42,31.75 38.05,32.12 U1.44 37.64,37.08 v35.94,37.08 | 38.42,31.75 U1.6 33.15,31.75 v32.13,30.73 31.54,30.73 30.35,29.54 21.9,29.54 v20.7,30.73 20.7,35.05 20.7,36 C1.1 | 39.75,30.42 38.42,31.75 | 39.75,29.97 39.75,27.43 39.75,26.11 | 39.75,29.97 39.75,30.42 | 39.75,30.42 42.07,32.74 43.34,34.01 | 43.34,34.01 44.61,35.28 46.03,36.7 U1.34 | U1.24 45.31,28.55 44.51,27.75 41.97,27.75 39.75,29.97 | U1.33 45.07,35.74 43.34,34.01 | 39.75,26.11 U1.14 | LED1.2 28.72,10.53 v28.32,10.92 | LED8.2 27.19,14.59 LED8.2 | LED8.2 26.84,14.52 27.9,13.46 v28.32,13.46 28.75,13.46 29.09,13.8 31.37,13.8 32.13,14.56 32.99,14.56 33.02,14.59 LED2.2 33.37,14.08 33.96,13.49 33.97,13.49 34.1,13.36 34.1,13.35 34.73,12.73 35.89,12.73 36.58,13.41 36.58,14.73 | U1.14 39.75,25.91 39.75,23.78 40.47,23.07 40.47,19.86 v40.51,19.81 | LED5.2 30.07,22.11 29.86,22.33 29.86,23.63 v31.12,24.89 | v36.58,16 36.58,14.73 | 36.58,14.73 36.58,12.19 35.16,10.78 JP2.1 | LED7.2 24.23,22.07 25.13,22.97 LED6.2 25.75,23.7 24.54,24.92 21,28.45 v20.7,28.45 | LED3.2 35.91,21.44 35.08,22.28 LED4.2 33.15,24.21 v33.15,24.89 33.15,27.05 v34.04,27.94
  Bottom 0.152: 37.6,35.76 39.75,35.76 | 37.6,35.76 37.26,35.76 v35.94,37.08 | v28.32,10.92 28.32,12.3 v28.32,13.46 | v31.12,24.89 30.92,24.89 v33.15,24.89 | 39.75,35.76 40.31,36.32 42.29,36.32 43.91,36.32 C5.1 | 37.6,35.76 37.98,35.76 C3.1 | v32.13,30.73 33.78,29.08 33.78,28.19 v34.04,27.94 | v36.58,16 37.35,16 40.46,19.11 40.46,19.75 v40.51,19.81 | v20.7,30.73 v20.7,28.45 | U2.5 43.77,35.76 39.75,35.76
A0
  Top 0.152: JP3.6 40.44,41.86 U1.41
A1
  Top 0.152: JP3.5 42.67,41.55 41.77,40.65 | 41.77,40.65 41.25,40.13 | 41.25,40.13 41.77,40.65 | 41.77,40.65 41.25,40.13 | 41.25,40.13 U1.40
A2
  Top 0.152: U1.39 42.04,37.59 42.04,39.29 44.91,42.16 JP3.4
A3
  Top 0.152: JP3.3 46.64,41.05 45.27,41.05 42.83,38.61 U1.38
A4
  Top 0.152: U1.37 43.64,37.59 43.64,38.99 45.39,40.74 48.87,40.74 JP3.2
A5
  Top 0.152: 45.02,39.94 45.52,40.44 51.11,40.44 JP3.1 | 45.02,39.94 44.43,39.34 | 45.02,39.94 44.43,39.34 | 44.43,39.34 U1.36
AREF  (via drill 0.25)
  Top 0.152: U1.42 39.65,40.11 | 39.65,40.11 JP3.7 | 39.65,40.11 39.44,40.31 34.47,40.31 33.1,38.94 33.1,36.63 32.13,35.66 24.69,35.66 21.49,32.46 21.49,30.53 22.01,30.01 22.52,30.01 v23.24,30.73 | v23.24,28.45 27.54,24.16 v27.54,17.55
  Bottom 0.152: v27.54,17.55 27.54,17.49 27.78,17.24 27.78,11.13 27.65,10.99 26.6,10.99 25.58,9.97 C2.1 | v23.24,28.45 v23.24,30.73
EN  (via drill 0.25)
  Top 0.152: v33.66,11.18 32.13,9.65 v28.32,9.65 | v38.23,21.34 38.2,21.31 38.2,18.29 37.31,17.4 v37.21,17.4 | v19.69,17.27 17.8,15.38 JP1.5
  Bottom 0.152: U2.3 46.93,32.36 45.86,32.36 43.17,29.67 41.01,29.67 39.45,28.1 39.45,27.43 | v28.32,9.65 27.47,9.65 R3.2 | v38.23,21.34 38.74,21.34 39.75,22.35 39.75,23.24 39.45,23.55 39.45,27.43 | v33.66,11.18 34.07,11.59 34.07,16.66 34.8,17.4 v37.21,17.4 36.27,17.4 33.58,20.09 22.5,20.09 v19.69,17.27 | 39.45,27.43
GND  (via drill 0.25)
  Top 0.152: SW1.2 SW1.4 | U1.35 45.24,37.59 | U1.35 45.24,37.59 | U1.23 48.39,27.15 v48.39,26.16 | U1.23 49,27.76 49.29,28.05 51.18,29.95 51.18,36.32 51.18,38.86 50.32,39.73 47.37,39.73 | U1.35 45.24,36.99 43.3,35.05 v42.29,35.05 39.75,35.05 38.84,35.97 U1.43 | LED7.4 21.96,16.91 | 21.96,16.91 22.58,17.53 22.58,20.9 LED6.4 | LED2.4 28.99,12.84 28.03,11.88 26.05,11.88 25.09,12.84 LED8.4 23.27,12.08 LED1.4 | 21.96,16.91 22.98,16.91 23.64,16.25 24.83,16.25 26.45,17.88 | LED5.4 26.57,18 26.45,17.88 | 30.16,22.45 30.16,23.49 | LED4.4 30.89,21.73 30.16,22.45 | v40.39,24.38 40.44,24.44 U1.15 | 30.16,23.49 30.16,22.45 | 30.16,23.49 30.58,23.91 31.15,23.91 32.13,24.89 32.13,27.69 v32.89,28.45 | U1.35 45.24,37.59 | 47.37,39.73 46.95,39.73 46.97,39.73 | U1.35 45.24,37.59 | 45.68,38.46 45.7,38.46 | U1.35 45.24,38.02 | 45.24,38.02 45.68,38.46 | 45.24,38.02 45.26,38.02 45.54,38.3 45.54,38.32 45.68,38.46 | 46.97,39.73 45.7,38.46 | 45.7,38.46 45.68,38.46 | 47.37,39.73 46.97,39.73 | U1.23 46.51,26.49 46.51,24.49 45.36,23.34 JP2.8 | v30.86,30.73 32.47,32.34 34.67,32.34 34.87,32.54 U1.5 | 26.45,17.88 26.53,17.88 27.62,16.79 31.32,16.79 31.43,16.91 LED3.4
  Bottom 0.152: 42.29,18.79 41.54,18.03 | 42.29,18.79 41.54,18.03 | 42.29,18.79 42.6,19.09 42.6,20.37 v48.39,26.16 | 42.29,27.72 Y1.2 42.29,27.72 | v40.39,24.38 40.06,24.71 40.06,27.85 41.01,28.8 41.21,28.8 42.29,27.72 | v32.89,28.45 32.89,28.7 v30.86,30.73 30.86,31.24 29.99,32.11 CN1.1 | 41.54,18.03 36.89,13.39 36.89,12.69 30.83,6.63 27.61,6.63 27.13,7.11 24.51,7.11 23.24,8.38 23.24,9.65 | C2.2 23.24,10.6 23.24,9.65 | C4.2 23.24,13.78 23.24,9.65 | IC1.2 37.63,33.78 39.09,35.24 42.11,35.24 v42.29,35.05 43.28,35.05 44.11,34.23 45.7,34.23 45.78,34.31 46.71,35.24 | 46.71,35.24 48.1,35.24 48.23,35.1 48.23,35.05 | 48.23,34.36 48.23,35.05 | 46.71,35.24 46.71,37.22 C5.2 | 48.23,35.05 48.23,34.36 | U2.2 47.85,34.23 48.1,34.23 48.23,34.36
  pour Bottom (rank 2): -0.89,47.75 57.53,47.75 57.53,22.35 34.67,-0.51 19.43,-0.51 -0.89,19.81
  pour Top: -0.89,47.75 57.53,47.75 57.53,22.35 34.67,-0.51 19.43,-0.51 -0.89,19.81
INT4  (via drill 0.25)
  Top 0.152: U1.28 v49.15,31.75 | JP2.2 36.62,11.76 37.17,12.31 v37.21,16.64
  Bottom 0.152: v49.15,31.75 46.11,31.75 44.58,30.22 44.23,29.86 44.23,24.28 42.9,22.96 40.03,20.09 40.03,19.81 | 40.03,19.81 40.03,19.59 40.03,19.81 | 40.03,19.81 40.03,19.36 37.31,16.64 v37.21,16.64
INT5  (via drill 0.25)
  Top 0.152: v28.32,19.3 v28.32,22.35 | U1.29 48.79,32.54 v49.15,33.02 | v22.99,24.89 22.48,25.4 16.89,25.4 | 16.64,25.4 16.89,25.4 | 16.89,25.4 16.64,25.4 | 16.64,25.4 v16.13,25.91
  Bottom 0.152: 44.37,30.44 45.99,32.05 47.1,32.05 47.37,32.33 48.1,32.33 48.59,32.33 v49.15,33.02 | 44.37,30.44 44.28,30.35 44.37,30.44 | R7.1 27.05,18.03 v28.32,19.3 29.59,18.03 R6.2 | 39.97,22.14 39.88,22.05 | 32.13,22.35 29.59,22.35 | 29.59,22.35 32.13,22.35 | 29.59,22.35 v28.32,22.35 25.53,22.35 v22.99,24.89 | 39.97,22.14 39.88,22.05 | 39.88,22.05 38.56,20.73 37.21,20.73 36.3,21.64 34.96,21.64 | 32.13,22.35 34.24,22.35 34.46,22.14 | 34.46,22.14 34.96,21.64 | 41.14,29.36 42.29,29.36 | 42.29,29.36 43.29,29.36 44.37,30.44 | v16.13,25.91 9.59,25.91 7.48,28.02 JP1.11 | 34.96,21.64 34.46,22.14 | 40.06,22.23 40.06,22.35 | 40.06,22.35 40.06,23.37 39.75,23.67 39.75,27.98 41.14,29.36 | 42.29,29.36 41.14,29.36 | 40.06,22.35 40.06,22.23 | 40.06,22.23 39.97,22.14
INT6  (via drill 0.25)
  Top 0.152: v43.56,31.24 45.67,33.35 U1.30 | v23.88,24.89 22.92,25.84 17.21,25.84 v16.13,26.92
  Bottom 0.152: v43.56,31.24 42.29,29.97 40.88,29.97 39.14,28.23 39.14,23.42 39.45,23.11 39.45,22.55 39.24,22.35 38.84,21.94 37.21,21.94 35.08,21.94 34.07,22.96 25.81,22.96 v23.88,24.89 | JP1.12 6.06,30.12 9.26,26.92 v16.13,26.92
INT7
  Top 0.152: U1.12 38.05,24.62 38.77,23.91 38.77,16.72 38.08,16.03 JP2.3
LEDPIX  (via drill 0.25)
  Top 0.152: U1.32 47.88,35.05 v49.15,35.05 | LED1.1 32.13,8.78 33.52,10.16 v33.66,10.16
  Bottom 0.152: v49.15,35.05 49.66,35.03 49.91,34.78 49.91,31.65 49.07,30.81 47.37,29.11 47.37,27.43 46.49,26.55 46.49,24.69 44.49,22.7 43.22,21.42 42.29,20.5 42.29,19.22 36.59,13.51 36.59,12.81 33.93,10.16 v33.66,10.16
MISO  (via drill 0.25)
  Top 0.152: U1.11 36.3,22.78 37.72,21.36 37.7,21.34 37.7,18.64 v37.21,18.16 | v19.69,18.54 14.35,18.54 13.3,19.59 JP1.7
  Bottom 0.152: v19.69,18.54 21.54,20.39 33.7,20.39 35.94,18.16 v37.21,18.16
MOSI  (via drill 0.25)
  Top 0.152: 35.77,28.55 U1.10 35.77,28.55 | 35.77,28.55 35.33,28.11 35.33,25.55 35.33,24.89 35.99,24.23 35.99,22.66 37.19,21.46 37.19,19.07 v37.21,19.05 | v20.96,21.59 20.85,21.7 JP1.8
  Bottom 0.152: v37.21,19.05 35.48,19.05 33.73,20.8 21.97,20.8 21.74,20.8 v20.96,21.59
N$2  (via drill 0.25)
  Top 0.152: v23.24,31.75 26.24,34.75 26.37,34.75 26.37,34.74 26.61,34.74 26.62,34.75 33.96,34.75 v34.67,34.04
  Bottom 0.152: IC1.5 39.28,32.33 36.38,32.33 v34.67,34.04 | R5.1 7.15,42.67 16.78,42.67 23.55,35.91 23.55,33.14 23.73,32.97 23.73,32.23 v23.24,31.75
N$4  (via drill 0.25)
  Top 0.152: U1.3 35.6,34.14 35.6,34.13 34.64,33.17 26.95,33.17 v24.51,30.73 | v31.12,17.27 29.73,17.27 28.96,18.04 28.96,24 28.83,24.13 v24.51,28.45
  Bottom 0.152: v24.51,30.73 v24.51,28.45 | v31.12,17.27 30.32,16.48 30.32,12.5 R1.2
N$5  (via drill 0.25)
  Top 0.152: LED2.3 29.92,14.64 v31.36,14.64 | v33.4,17.63 35.19,17.63 LED3.1
  Bottom 0.152: v33.4,17.63 31.36,15.58 v31.36,14.64
N$6
  Top 0.152: LED4.1 34.39,20.63 LED3.3
N$7  (via drill 0.25)
  Top 0.152: v34.67,34.92 34.55,35.05 25.53,35.05 v23.24,32.77
  Bottom 0.152: R4.2 11.29,41.4 12.02,42.13 16.89,42.13 23.24,35.78 v23.24,32.77 | v34.67,34.92 36.77,32.83 IC1.1
N$8  (via drill 0.25)
  Top 0.152: LED11.C 12.03,40.13 v13.08,40.13
  Bottom 0.152: R4.1 12.66,40.55 v13.08,40.13
N$9  (via drill 0.25)
  Top 0.152: U1.4 35.25,33.35 34.54,32.64 27.69,32.64 v25.78,30.73 | v31.12,19.56 30.95,19.56 30.67,19.27 29.48,19.27 29.34,19.41 29.34,24.89 v25.78,28.45
  Bottom 0.152: R2.2 32.13,13 30.75,14.39 30.75,16.05 31.72,17.02 31.72,17.52 31.72,18.95 v31.12,19.56 | v25.78,30.73 v25.78,28.45
N$10  (via drill 0.25)
  Top 0.152: J1.2 27.67,6.97 v27.81,7.11
  Bottom 0.152: v27.81,7.11 29.59,8.89 R1.1
N$11  (via drill 0.25)
  Top 0.152: v28.83,7.11 28.32,6.6 J1.3
  Bottom 0.152: v28.83,7.11 29.17,7.11 R2.1
N$12  (via drill 0.25)
  Top 0.152: U1.16 41.25,24.41 v41.23,24.38
  Bottom 0.152: 43.65,27.27 Y1.3 43.65,27.27 | 43.65,27.27 43.65,24.73 42.83,23.9 41.71,23.9 v41.23,24.38
N$13  (via drill 0.25)
  Top 0.152: U1.17 v42.04,24.38
  Bottom 0.152: Y1.1 40.95,27.2 40.95,25.47 v42.04,24.38
N$14
  Top 0.152: LED2.1 33.37,12.58 32.32,11.53 28.07,11.53 27.07,10.53 LED1.3
N$15  (via drill 0.25)
  Top 0.152: LED8.1 26.77,12.91 26,13.68 25.74,13.94 23.87,13.94 22.25,13.94 v22.24,13.95 | v21.97,17.78 21.61,17.78 LED7.3
  Bottom 0.152: v21.97,17.78 21.97,14.22 v22.24,13.95
N$17
  Top 0.152: LED6.3 22.25,22.47 22.98,21.74 22.98,18.28 22.98,18.15 LED7.1
N$18
  Top 0.152: LED5.1 30.59,18.17 31.72,19.31 31.72,22.14 LED4.3
N$22
  Top 0.152: LED5.3 25.75,21 LED6.1
RST  (via drill 0.25)
  Top 0.152: SW1.3 10.51,36.35 10.54,36.32 | 10.54,36.32 14.35,32.51 14.35,27 16.46,24.89 v22.1,24.89 | SW1.1 8.25,36.32 10.54,36.32 | 38.84,24.26 38.98,24.12 | U1.13 38.84,24.26 | 38.84,24.26 38.98,24.12 | 38.98,24.12 39.5,23.6 v39.5,20.83 39.5,13.22 JP2.4
  Bottom 0.152: v39.5,20.83 39.09,20.83 38.69,20.42 37.21,20.42 | 37.06,20.42 37.21,20.42 | v22.1,24.89 25.12,21.87 34.29,21.87 34.83,21.33 35.63,21.33 36.15,21.33 37.06,20.42 | 37.21,20.42 37.06,20.42
SCL
  Top 0.152: U1.18 42.83,21.52 40.99,19.68 JP2.5
SCLK  (via drill 0.25)
  Top 0.152: v36.71,19.77 36.71,19.94 36.89,20.12 36.89,21.34 35.69,22.53 35.69,24.1 35.03,24.77 35.03,29.11 35.28,29.36 U1.9 | v21.21,22.35 14.35,22.35 12.9,23.81 JP1.9
  Bottom 0.152: v36.71,19.77 36.66,19.81 35.15,19.81 33.85,21.11 22.46,21.11 v21.21,22.35
SDA
  Top 0.152: U1.19 43.64,21.63 43.32,21.32 42.45,20.44 JP2.6
SS  (via drill 0.25)
  Top 0.152: U1.8 35.64,30.15 34.72,29.23 34.72,24.89 34.72,24.64 35.38,23.98 35.38,22.41 36.32,21.46 36.32,20.47 v36.4,20.39 | JP1.10 15.01,25.91 16.34,24.59 21.52,24.59 v21.85,24.26
  Bottom 0.152: v36.4,20.39 35,20.39 33.98,21.41 24.51,21.41 21.79,24.13 v21.85,24.26
VBAT  (via drill 0.25)
  Top 0.152: v25.53,19.56 25.03,20.06 25.03,21.74 25.6,22.32 26.35,22.32 26.48,22.45 26.48,23.94 v21.97,28.45 21.49,28.93 16.61,28.93 v16.13,28.45 | v21.97,30.73 21.97,32.51 24.82,35.36 33.96,35.36 34.42,35.81 v34.67,35.81 | v19.69,16 16.96,13.28 JP1.4
  Bottom 0.152: 14.93,28.7 14.14,29.82 D1.A | v21.97,28.45 v21.97,30.73 22.51,31.27 23.44,31.27 25.81,31.27 26.65,32.11 CN1.2 | C6.1 14.17,27.94 14.93,28.7 | R7.2 27.05,15.23 25.53,16.75 v25.53,19.56 23.07,19.56 19.69,16.18 v19.69,16 | IC1.3 36.26,34.73 35.18,35.81 v34.67,35.81 | 14.93,28.7 15.88,28.7 v16.13,28.45
VBUS  (via drill 0.25)
  Top 0.152: v38.99,30.32 37.44,30.32 36.8,30.96 U1.7 36.24,30.91 35.74,30.91 34.74,29.91 34.14,29.31 | J1.1 27.02,7.11 26.01,8.12 25.98,8.12 22.23,11.88 v22.23,13.21 22.39,13.21 22.68,13.49 25.33,13.49 v25.49,13.33 26.04,12.78 26.04,12.32 26.18,12.19 27.91,12.19 29.21,13.49 32.34,13.49 v32.42,13.57 | v34.63,18.29 35.12,18.78 35.12,21.74 34.54,22.32 33.8,22.32 32.67,23.45 32.67,27.49 34.14,28.97 34.14,29.31 | LED11.A 11.81,35.48 14.57,32.73 14.66,32.64 14.66,32.51 | 16.69,30.18 v16.13,30.73 16.69,30.18 | 14.66,32.51 14.66,32.21 | 16.69,30.18 17.63,29.23 34.07,29.23 34.14,29.31 | 14.66,32.51 14.66,32.21 | 14.66,32.21 16.69,30.18
  Bottom 0.152: IC1.4 41.86,34.73 42.29,34.3 42.29,32.87 42.12,32.69 | U2.1 47.05,34.73 45.96,33.64 43.07,33.64 42.12,32.69 | v38.99,30.32 39.75,30.32 42.12,32.69 | D1.C 11.94,30.48 12.87,31.41 15.46,31.41 v16.13,30.73 | C4.1 24.51,16.77 25.49,15.8 v25.49,13.33 R3.1 | v34.63,18.29 34.63,17.66 32.42,15.45 v32.42,13.57 | JP1.6 16.89,17.49 21.17,13.21 v22.23,13.21

### Text on the board
tPlace: SacredHeart | 1 | ARF | A0 | A1 | A2 | A3 | A4 | A5 | INT6 | INT5 | SS | SCLK | MOSI | GND | MISO | 2 | VBUS | SDA | EN | SCL | VBAT | RST | 8 | INT7 | 9 | INT4 | 10 | +3V3
bPlace: 1 | ARF | A0 | A1 | A2 | A3 | A4 | A5 | ATmega32u4 / 3.7V/4.2V LiPoly | INT6 | INT5 | SS | SCLK | MOSI | GND | MISO | 2 | VBUS | SDA | EN | SCL | VBAT | RST | 8 | INT7 | 9 | INT4 | 10 | +3V3
bStop: SacredHeart